# EAGLE design perfCard (EAGLE 8.4.0)
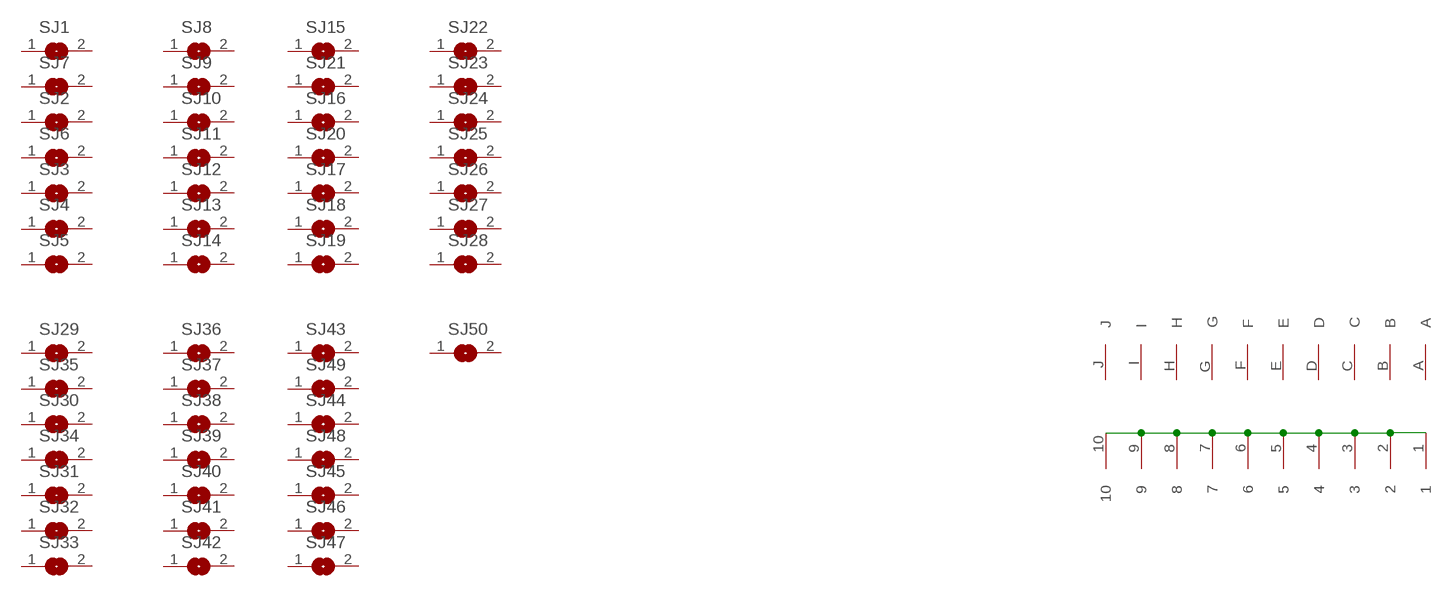
[diagram p0: schematic, sheet 1]

## Parts
SJ1  SJ  [SJ]
SJ2  SJ  [SJ]
SJ3  SJ  [SJ]
SJ4  SJ  [SJ]
SJ5  SJ  [SJ]
SJ6  SJ  [SJ]
SJ7  SJ  [SJ]
SJ8  SJ  [SJ]
SJ9  SJ  [SJ]
SJ10  SJ  [SJ]
SJ11  SJ  [SJ]
SJ12  SJ  [SJ]
SJ13  SJ  [SJ]
SJ14  SJ  [SJ]
SJ15  SJ  [SJ]
SJ16  SJ  [SJ]
SJ17  SJ  [SJ]
SJ18  SJ  [SJ]
SJ19  SJ  [SJ]
SJ20  SJ  [SJ]
SJ21  SJ  [SJ]
SJ22  SJ  [SJ]
SJ23  SJ  [SJ]
SJ24  SJ  [SJ]
SJ25  SJ  [SJ]
SJ26  SJ  [SJ]
SJ27  SJ  [SJ]
SJ28  SJ  [SJ]
SJ29  SJ  [SJ]
SJ30  SJ  [SJ]
SJ31  SJ  [SJ]
SJ32  SJ  [SJ]
SJ33  SJ  [SJ]
SJ34  SJ  [SJ]
SJ35  SJ  [SJ]
SJ36  SJ  [SJ]
SJ37  SJ  [SJ]
SJ38  SJ  [SJ]
SJ39  SJ  [SJ]
SJ40  SJ  [SJ]
SJ41  SJ  [SJ]
SJ42  SJ  [SJ]
SJ43  SJ  [SJ]
SJ44  SJ  [SJ]
SJ45  SJ  [SJ]
SJ46  SJ  [SJ]
SJ47  SJ  [SJ]
SJ48  SJ  [SJ]
SJ49  SJ  [SJ]
SJ50  SJ  [SJ]
U$1  CONN2X10  [CONN2X10]

## Nets
N$1: U$1.1 U$1.2 U$1.3 U$1.4 U$1.5 U$1.6 U$1.7 U$1.8 U$1.9 U$1.10
Unconnected: SJ1.1 SJ1.2 SJ2.1 SJ2.2 SJ3.1 SJ3.2 SJ4.1 SJ4.2 SJ5.1 SJ5.2 SJ6.1 SJ6.2 SJ7.1 SJ7.2 SJ8.1 SJ8.2 SJ9.1 SJ9.2 SJ10.1 SJ10.2 SJ11.1 SJ11.2 SJ12.1 SJ12.2 SJ13.1 SJ13.2 SJ14.1 SJ14.2 SJ15.1 SJ15.2 SJ16.1 SJ16.2 SJ17.1 SJ17.2 SJ18.1 SJ18.2 SJ19.1 SJ19.2 SJ20.1 SJ20.2 SJ21.1 SJ21.2 SJ22.1 SJ22.2 SJ23.1 SJ23.2 SJ24.1 SJ24.2 SJ25.1 SJ25.2 SJ26.1 SJ26.2 SJ27.1 SJ27.2 SJ28.1 SJ28.2 SJ29.1 SJ29.2 SJ30.1 SJ30.2 SJ31.1 SJ31.2 SJ32.1 SJ32.2 SJ33.1 SJ33.2 SJ34.1 SJ34.2 SJ35.1 SJ35.2 SJ36.1 SJ36.2 SJ37.1 SJ37.2 SJ38.1 SJ38.2 SJ39.1 SJ39.2 SJ40.1 SJ40.2 SJ41.1 SJ41.2 SJ42.1 SJ42.2 SJ43.1 SJ43.2 SJ44.1 SJ44.2 SJ45.1 SJ45.2 SJ46.1 SJ46.2 SJ47.1 SJ47.2 SJ48.1 SJ48.2 SJ49.1 SJ49.2 SJ50.1 SJ50.2 U$1.A U$1.B U$1.C U$1.D U$1.E U$1.F U$1.G U$1.H U$1.I U$1.J

## Library data of the parts
SJ1-SJ50 = jumper:SJ: SMD solder JUMPER
U$1 = edgeConn2x10:CONN2X10: Pads for edge connector 10/20. Pads size: 80x340mil. Spacing: 156 mil.

## Board
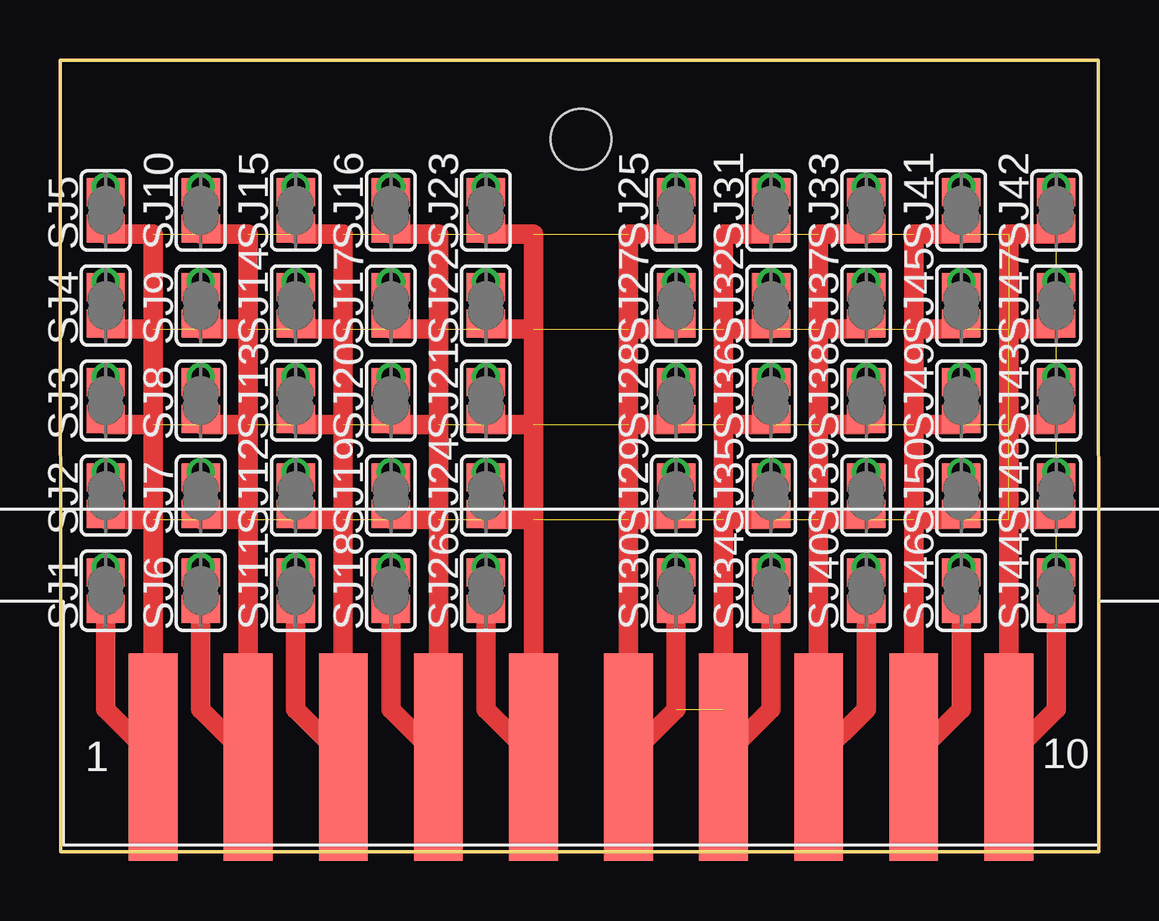
[diagram p1: board, top side]
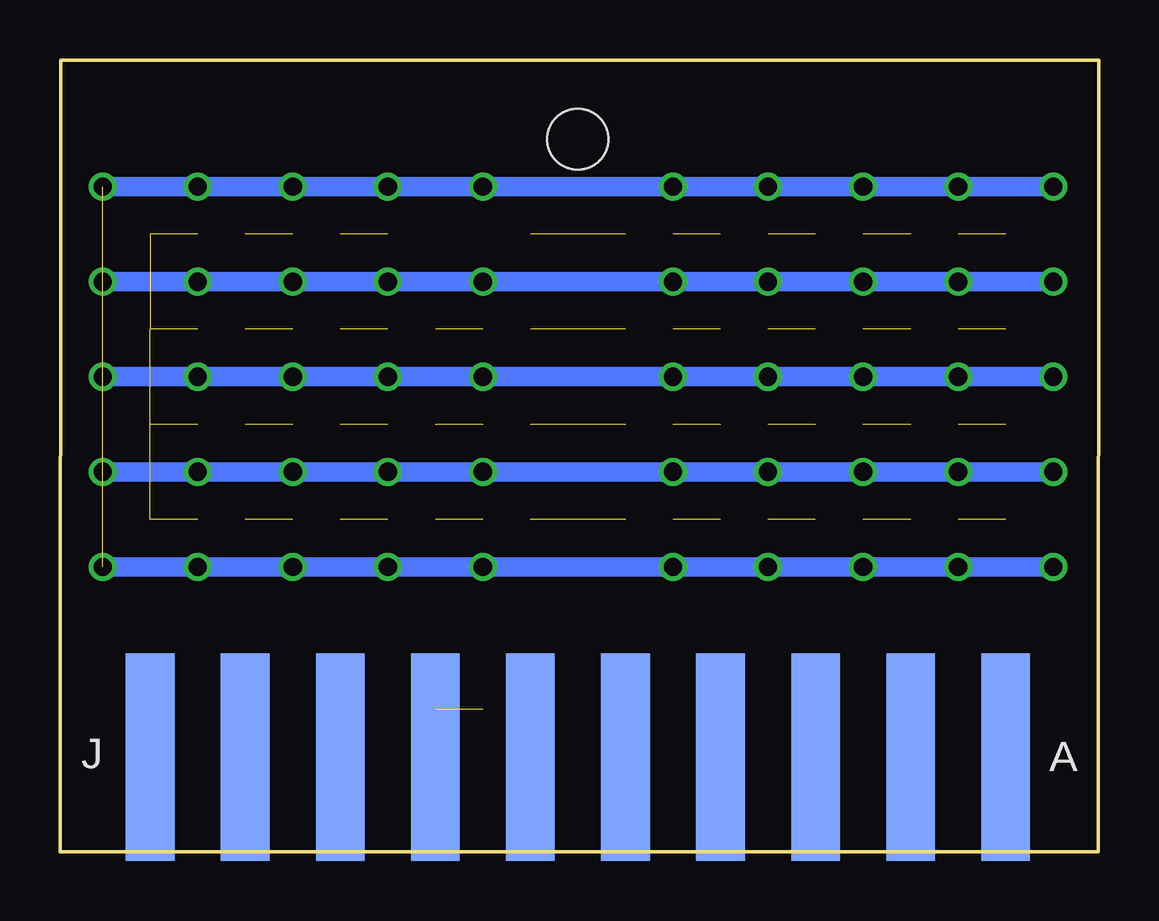
[diagram p2: board, bottom side, seen from below]

Size 43.31 x 33.02 mm. Coordinates in mm from the lower left corner, seen from the top.
Outline: 0,33.02 43.28,33.02 43.31,0 0.03,0 0,33.02
Copper layers (1*16): Top 0.035mm / dielectric 1.5mm / Bottom 0.035mm
Design rules "default": minimum track width 6mil, minimum drill 0.35mm, track to track 6mil, track to pad 6mil, pad to pad 6mil, via to via 6mil, smd to smd 6mil, copper to edge 40mil, drill to drill 6mil, minimum pad ring 10mil, minimum via ring 8mil, stop-mask expansion 4mil, vias tented up to drill 0mil, thermal gap 10mil
Holes 2.54 mm at 21.72,29.72

### Footprints (pad centres in the part's own frame; a part is rotated, then mirrored left to right if it is on the bottom)
SJ = smd 1.168 x 1.6: 1 -0.762,0; 2 0.762,0
CONN2X10 = smd 2.032 x 8.636: 1 17.831,3.962; 2 13.868,3.962; 3 9.906,3.962; 4 5.944,3.962; 5 1.981,3.962; 6 -1.981,3.962; 7 -5.944,3.962; 8 -9.906,3.962; 9 -13.868,3.962; 10 -17.831,3.962 | smd 2.032 x 8.636 bottom: A 17.831,3.962; B 13.868,3.962; C 9.906,3.962; D 5.944,3.962; E 1.981,3.962; F -1.981,3.962; G -5.944,3.962; H -9.906,3.962; I -13.868,3.962; J -17.831,3.962

### Placement (x,y rotation side)
SJ1  1.91,10.9 90 top
SJ2  1.91,14.86 90 top
SJ3  1.91,18.82 90 top
SJ4  1.91,22.78 90 top
SJ5  1.91,26.75 90 top
SJ6  5.87,10.9 90 top
SJ7  5.87,14.86 90 top
SJ8  5.87,18.82 90 top
SJ9  5.87,22.78 90 top
SJ10  5.87,26.75 90 top
SJ11  9.83,10.9 90 top
SJ12  9.83,14.86 90 top
SJ13  9.83,18.82 90 top
SJ14  9.83,22.78 90 top
SJ15  9.83,26.75 90 top
SJ16  13.79,26.75 90 top
SJ17  13.79,22.78 90 top
SJ18  13.79,10.9 90 top
SJ19  13.79,14.86 90 top
SJ20  13.79,18.82 90 top
SJ21  17.75,18.82 90 top
SJ22  17.75,22.78 90 top
SJ23  17.75,26.75 90 top
SJ24  17.75,14.86 90 top
SJ25  25.68,26.75 90 top
SJ26  17.75,10.9 90 top
SJ27  25.68,22.78 90 top
SJ28  25.68,18.82 90 top
SJ29  25.68,14.86 90 top
SJ30  25.68,10.9 90 top
SJ31  29.64,26.75 90 top
SJ32  29.64,22.78 90 top
SJ33  33.6,26.75 90 top
SJ34  29.64,10.9 90 top
SJ35  29.64,14.86 90 top
SJ36  29.64,18.82 90 top
SJ37  33.6,22.78 90 top
SJ38  33.6,18.82 90 top
SJ39  33.6,14.86 90 top
SJ40  33.6,10.9 90 top
SJ41  37.57,26.75 90 top
SJ42  41.53,26.75 90 top
SJ43  41.53,18.82 90 top
SJ44  41.53,10.9 90 top
SJ45  37.57,22.78 90 top
SJ46  37.57,10.9 90 top
SJ47  41.53,22.78 90 top
SJ48  41.53,14.86 90 top
SJ49  37.57,18.82 90 top
SJ50  37.57,14.86 90 top
U$1  21.72,7.92 180 top

### Tracks (layer width: path | path; a pad name or v marks a point on that pad's centre or on a via)
N$1  (39 unrouted)
  Top 0.813: U$1.4 15.77,25.76 13.79,25.76 | U$1.6 23.7,25.76 25.68,25.76 | U$1.7 27.66,25.76 29.64,25.76 | 15.77,17.83 13.79,17.83 | 15.77,21.79 13.79,21.79 | U$1.4 15.77,5.94 | 15.77,13.87 13.79,13.87 | 3.89,13.87 1.9,13.87 | 3.89,17.83 1.9,17.83 | 3.89,21.79 1.9,21.79 | 1.9,25.76 3.89,25.76 U$1.1 1.9,5.94 1.9,9.91 | 5.87,25.76 7.85,25.76 U$1.2 5.87,5.94 5.87,9.91 | 7.85,21.79 5.87,21.79 | 7.85,17.83 5.87,17.83 | 7.85,13.87 5.87,13.87 | U$1.6 23.7,5.94 | U$1.7 27.66,5.94 | U$1.6 25.68,5.94 25.68,9.91 | U$1.7 29.64,5.94 29.64,9.91 | U$1.4 13.79,5.94 13.79,9.91 | 11.81,13.87 9.83,13.87 | 11.81,17.83 9.83,17.83 | 11.81,21.79 9.83,21.79 | 9.83,25.76 11.81,25.76 U$1.3 9.83,5.94 9.83,9.91 | 19.74,17.83 17.75,17.83 | 19.74,21.79 17.75,21.79 | 17.75,25.76 19.74,25.76 U$1.5 17.75,5.94 17.75,9.91 | 23.7,21.79 25.68,21.79 | 23.7,17.83 25.68,17.83 | 23.7,13.87 25.68,13.87 | 27.66,13.87 29.64,13.87 | 27.66,17.83 29.64,17.83 | 27.66,21.79 29.64,21.79 | 31.62,13.87 33.6,13.87 | 31.62,17.83 33.6,17.83 | 31.62,21.79 33.6,21.79 | 33.6,25.76 31.62,25.76 U$1.8 33.6,5.94 33.6,9.91 | 37.57,25.76 35.59,25.76 U$1.9 37.57,5.94 37.57,9.91 | 35.59,21.79 37.57,21.79 | 35.59,17.83 37.57,17.83 | 35.59,13.87 37.57,13.87 | 39.55,13.87 41.53,13.87 | 39.55,17.83 41.53,17.83 | 39.55,21.79 41.53,21.79 | 41.53,25.76 39.55,25.76 U$1.10 41.53,5.94 41.53,9.91 | 19.74,13.87 17.75,13.87
N$101  (via drill 0.76)  (4 unrouted)
  Bottom 0.813: v1.9,27.74 v5.87,27.74 v9.83,27.74 v13.79,27.74 v17.75,27.74 v25.68,27.74 v29.64,27.74 v33.6,27.74 v37.57,27.74 v41.53,27.74 | v1.9,23.77 v5.87,23.77 v9.83,23.77 v13.79,23.77 v17.75,23.77 v25.68,23.77 v29.64,23.77 v33.6,23.77 v37.57,23.77 v41.53,23.77 | v1.9,19.81 v5.87,19.81 v9.83,19.81 v13.79,19.81 v17.75,19.81 v25.68,19.81 v29.64,19.81 v33.6,19.81 v37.57,19.81 v41.53,19.81 | v1.9,15.85 v5.87,15.85 v9.83,15.85 v13.79,15.85 v17.75,15.85 v25.68,15.85 v29.64,15.85 v33.6,15.85 v37.57,15.85 v41.53,15.85 | v1.9,11.89 v5.87,11.89 v9.83,11.89 v13.79,11.89 v17.75,11.89 v25.68,11.89 v29.64,11.89 v33.6,11.89 v37.57,11.89 v41.53,11.89

### Text on the board
tDocu: 1 | 10
bDocu: PERFCARD v. 1.0.1